# EAGLE schematic esp07 (EAGLE 7.2.0)
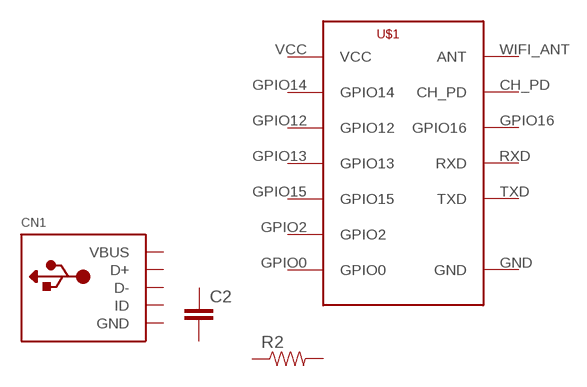
[diagram p0: schematic, sheet 1]

## Parts
C2  CAP0805  [0805]
CN1  USBMOLEX  [USB-MINIB-THM-MOLEX]
R2  RESISTOR0805-RES  [0805]
U$1  ESP8266-03  [ESP-03]
Unconnected: C2.1 C2.2 CN1.D+ CN1.D- CN1.ID R2.1 R2.2 U$1.CH_PD U$1.GPIO0 U$1.GPIO2 U$1.GPIO12 U$1.GPIO13 U$1.GPIO14 U$1.GPIO15 U$1.GPIO16 U$1.RXD U$1.TXD U$1.WIFI_ANT(ANT)

## Power pins joined to a net without a drawn wire
GND: CN1.GND U$1.GND
VBUS: CN1.VBUS
VCC: U$1.VCC

## Library data of the parts
C2 = SparkFun-Capacitors:CAP: Capacitor Standard 0603 ceramic capacitor, and 0.1" leaded capacitor.
CN1 = adafruit:USB: USB Connectors USBMINIB - Surface Mount Female Mini-B USB Connector 4UConnector: 06564 By microbuilder.eu Thru-hole RA Female Mini-B USB Connector 4UConnector: 18732 By ladyada.net
R2 = SparkFun-Resistors:RESISTOR: Resistor Basic schematic elements and footprints for 0603, 1206, and PTH resistors.
U$1 = lio:ESP8266-03